# EAGLE design midi-in-out-single (EAGLE 7.7.0)
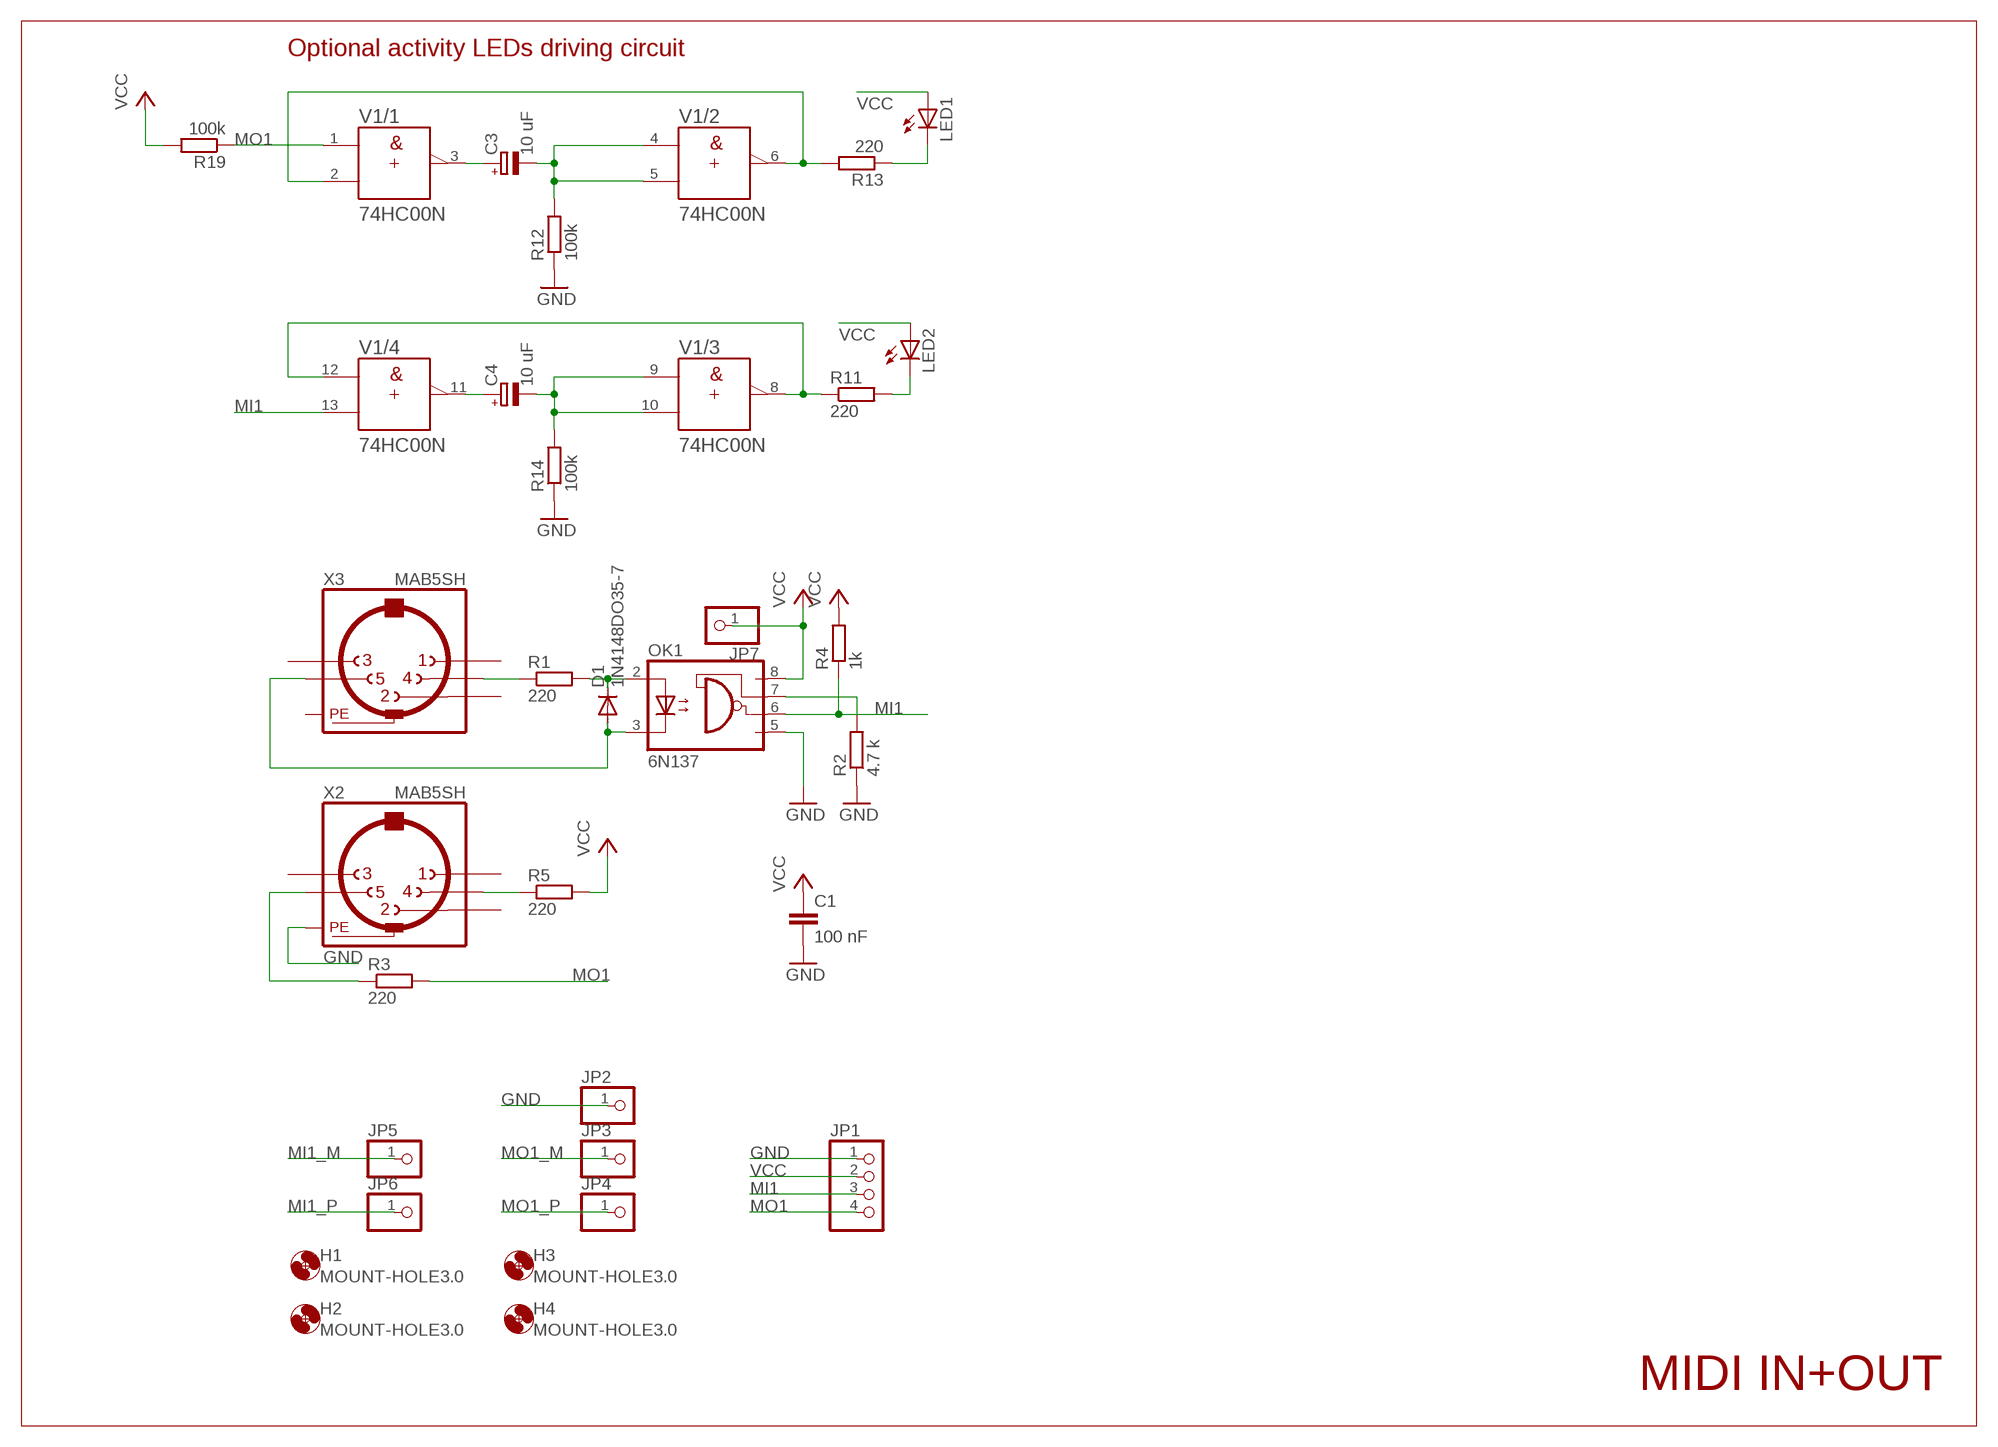
[diagram p0: schematic, sheet 1]

## Parts
C1  100 nF  C-EU025-024X044  [C025-024X044]
C3  10 uF  CPOL-EUE2.5-5  [E2,5-5]
C4  10 uF  CPOL-EUE2.5-5  [E2,5-5]
D1  1N4148DO35-7  [DO35-7]
H1  MOUNT-HOLE3.0  [3,0]
H2  MOUNT-HOLE3.0  [3,0]
H3  MOUNT-HOLE3.0  [3,0]
H4  MOUNT-HOLE3.0  [3,0]
JP1  PINHD-1X4/90  [1X04/90]
JP2  PINHD-1X1  [1X01]
JP3  PINHD-1X1  [1X01]
JP4  PINHD-1X1  [1X01]
JP5  PINHD-1X1  [1X01]
JP6  PINHD-1X1  [1X01]
JP7  PINHD-1X1  [1X01]
LED1  LED3MM  [LED3MM]
LED2  LED3MM  [LED3MM]
OK1  6N137  [DIL08]
R1  220  R-EU_0204/7  [0204/7]
R2  4.7 k  R-EU_0204/7  [0204/7]
R3  220  R-EU_0204/7  [0204/7]
R4  1k  R-EU_0204/7  [0204/7]
R5  220  R-EU_0204/7  [0204/7]
R11  220  R-EU_0204/7  [0204/7]
R12  100k  R-EU_0204/7  [0204/7]
R13  220  R-EU_0204/7  [0204/7]
R14  100k  R-EU_0204/7  [0204/7]
R19  100k  R-EU_0204/7  [0204/7]
V1  74HC00N  [DIL14]
X2  MAB5SH  [MAB5SH]
X3  MAB5SH  [MAB5SH]

## Nets
GND: C1.2 JP1.1 JP2.1 OK1.5(GND) R2.1 R12.1 R14.1 X2.PE X2.PE@(PE)
MI1: JP1.3 OK1.6(VO) R4.1 V1.13(/4:B)
MI1_M: D1.A JP5.1 OK1.3(C) X3.5
MI1_P: JP6.1 R1.1 X3.4
MO1: JP1.4 R3.2 R19.1 V1.1(/1:A)
MO1_M: JP3.1 R3.1 X2.5
MO1_P: JP4.1 R5.1 X2.4
N$1: D1.C OK1.2(A) R1.2
N$3: OK1.7(VE) R2.2
N$8: LED2.K(C) R11.2
N$10: LED1.K(C) R13.1
N$15: C4.+ V1.11(/4:Y)
N$16: C3.- R12.2 V1.4(/2:A) V1.5(/2:B)
N$17: C3.+ V1.3(/1:Y)
N$18: R13.2 V1.2(/1:B) V1.6(/2:Y)
N$19: C4.- R14.2 V1.9(/3:A) V1.10(/3:B)
N$20: R11.1 V1.8(/3:Y) V1.12(/4:A)
VCC: C1.1 JP1.2 JP7.1 LED1.A LED2.A OK1.8(VCC) R4.2 R5.2 R19.2
Unconnected: X2.1 X2.2 X2.3 X3.1 X3.2 X3.3

## Notes on the sheet
- Optional activity LEDs driving circuit
- MIDI IN+OUT

## Power pins joined to a net without a drawn wire
GND: V1.7(/-UB:-UB)
PE: X3.PE X3.PE@(PE)
VCC: V1.14(/+UB:+UB)

## Library data of the parts
C1 = rcl:C-EU: CAPACITOR, European symbol
C3 C4 = rcl:CPOL-EU: POLARIZED CAPACITOR, European symbol
D1 = diode:1N4148: DIODE high speed (Philips)
H1-H4 = holes:MOUNT-HOLE: MOUNTING HOLE with drill center marker
JP1 = pinhead:PINHD-1X4: PIN HEADER
JP2-JP7 = pinhead:PINHD-1X1: PIN HEADER
LED1 LED2 = led:LED: LED OSRAM: - CHIPLED LG R971, LG N971, LY N971, LG Q971, LY Q971, LO R971, LY R971 LH N974, LH R974 LS Q976, LO Q976, LY Q976 LO Q996 - Hyper CHIPLED LW Q18S LB Q993, LB Q99A, LB R99A - SideLED LS A670, LO A670, LY A670, LG A670, LP A670 LB A673, LV A673, LT A673, LW A673 LH A674 LY A675 LS A676, LA A676, LO A676, LY A676, LW A676 LS A679, LY A679, LG A679 - Hyper Micro SIDELED® LS Y876, LA Y876, LO Y876, LY Y876 LT Y87S - SmartLED LW L88C, LW L88S LB L89C, LB L89S, LG L890 LS L89K, LO L89K, LY L89K LS L896, LA L896, LO L896, LY L896 - TOPLED LS T670, LO T670, LY T670, LG T670, LP T670 LSG T670, LSP T670, LSY T670, LOP T670, LYG T670 LG T671, LOG T671, LSG T671 LB T673, LV T673, LT T673, LW T673 LH T674 LS T676, LA T676, LO T676, LY T676, LB T676, LH T676, LSB T676, LW T676 LB T67C, LV T67C, LT T67C, LS T67K, LO T67K, LY T67K, LW E67C LS E67B, LA E67B, LO E67B, LY E67B, LB E67C, LV E67C, LT E67C LW T67C LS T679, LY T679, LG T679 LS T770, LO T770, LY T770, LG T770, LP T770 LB T773, LV T773, LT T773, LW T773 LH T774 LS E675, LA E675, LY E675, LS T675 LS T776, LA T776, LO T776, LY T776, LB T776 LHGB T686 LT T68C, LB T68C - Hyper Mini TOPLED® LB M676 - Mini TOPLED Santana® LG M470 LS M47K, LO M47K, LY M47K Source: http://www.osram.convergy.de LUXEON: - LUMILED® LXK2-PW12-R00, LXK2-PW12-S00, LXK2-PW14-U00, LXK2-PW14-V00 LXK2-PM12-R00, LXK2-PM12-S00, LXK2-PM14-U00 LXK2-PE12-Q00, LXK2-PE12-R00, LXK2-PE12-S00, LXK2-PE14-T00, LXK2-PE14-U00 LXK2-PB12-K00, LXK2-PB12-L00, LXK2-PB12-M00, LXK2-PB14-N00, LXK2-PB14-P00, LXK2-PB14-Q00 LXK2-PR12-L00, LXK2-PR12-M00, LXK2-PR14-Q00, LXK2-PR14-R00 LXK2-PD12-Q00, LXK2-PD12-R00, LXK2-PD12-S00 LXK2-PH12-R00, LXK2-PH12-S00 LXK2-PL12-P00, LXK2-PL12-Q00, LXK2-PL12-R00 Source: www.luxeon.com KINGBRIGHT: KA-3528ASYC Source: www.kingbright.com
OK1 = optocoupler:6N137: MOTOROLA OPTO COUPLER; MPN: 6N137; OC_FARNELL: 1328376; OC_NEWARK: 52M1895
R1-R5 R11-R14 R19 = rcl:R-EU_: RESISTOR, European symbol
V1 = 74ttl-din:74*00: Quad 2-input NAND gate
X2 X3 = con-hirschmann:MAB5SH: Female CONNECTOR 5 pins 90 deg. with shield, horizontal (DIN 41524); OC_FARNELL: 809883; OC_NEWARK: unknown

## Board
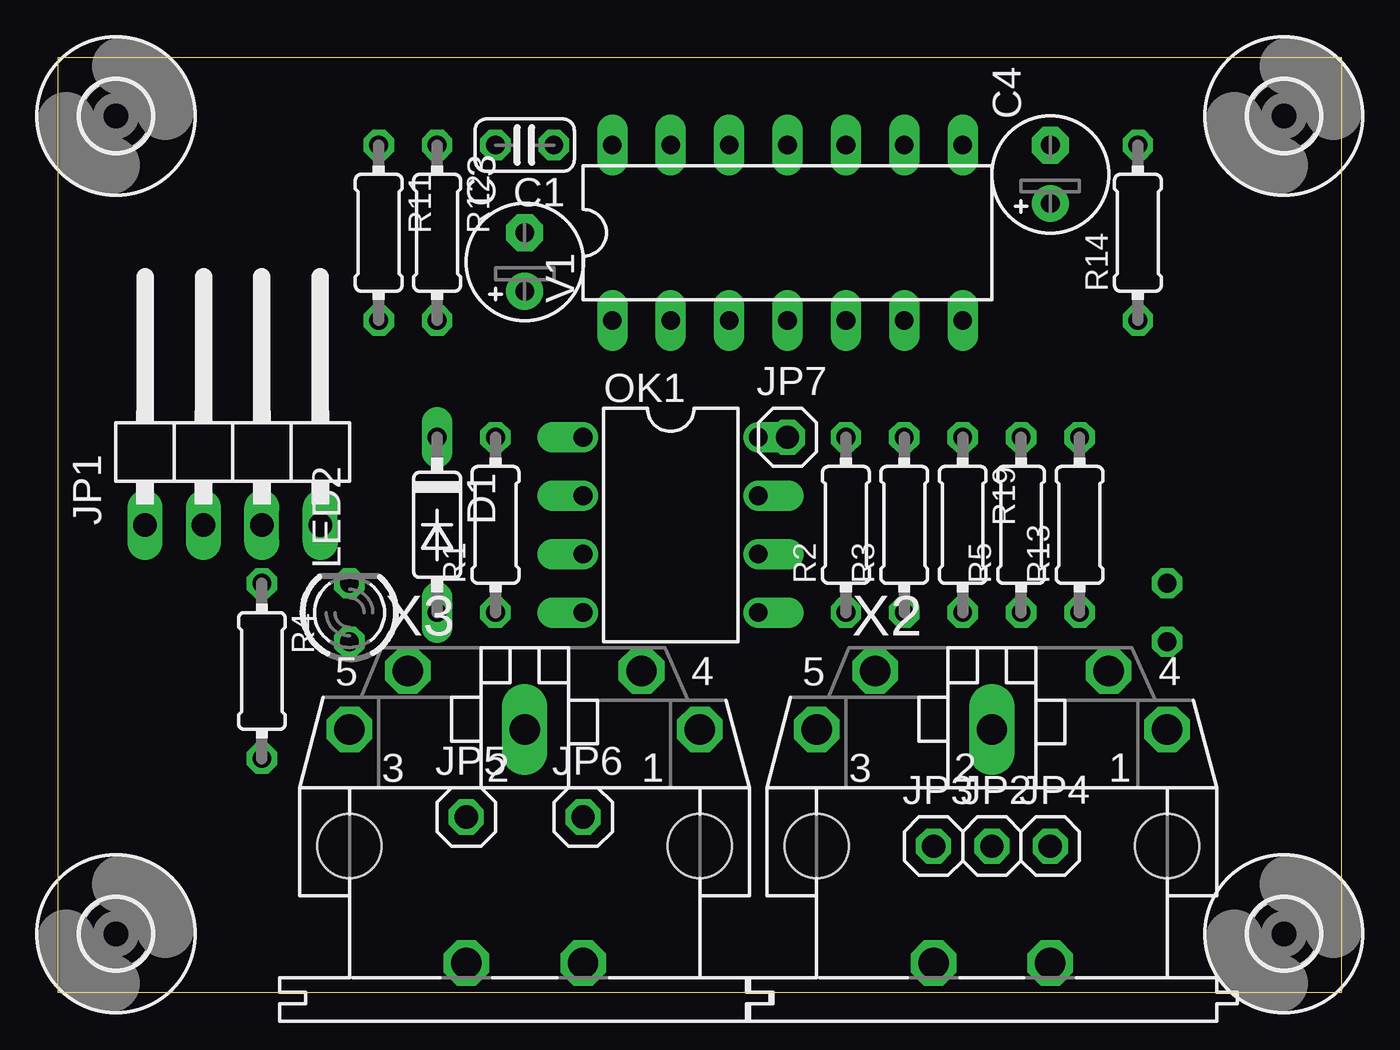
[diagram p1: board, top side]
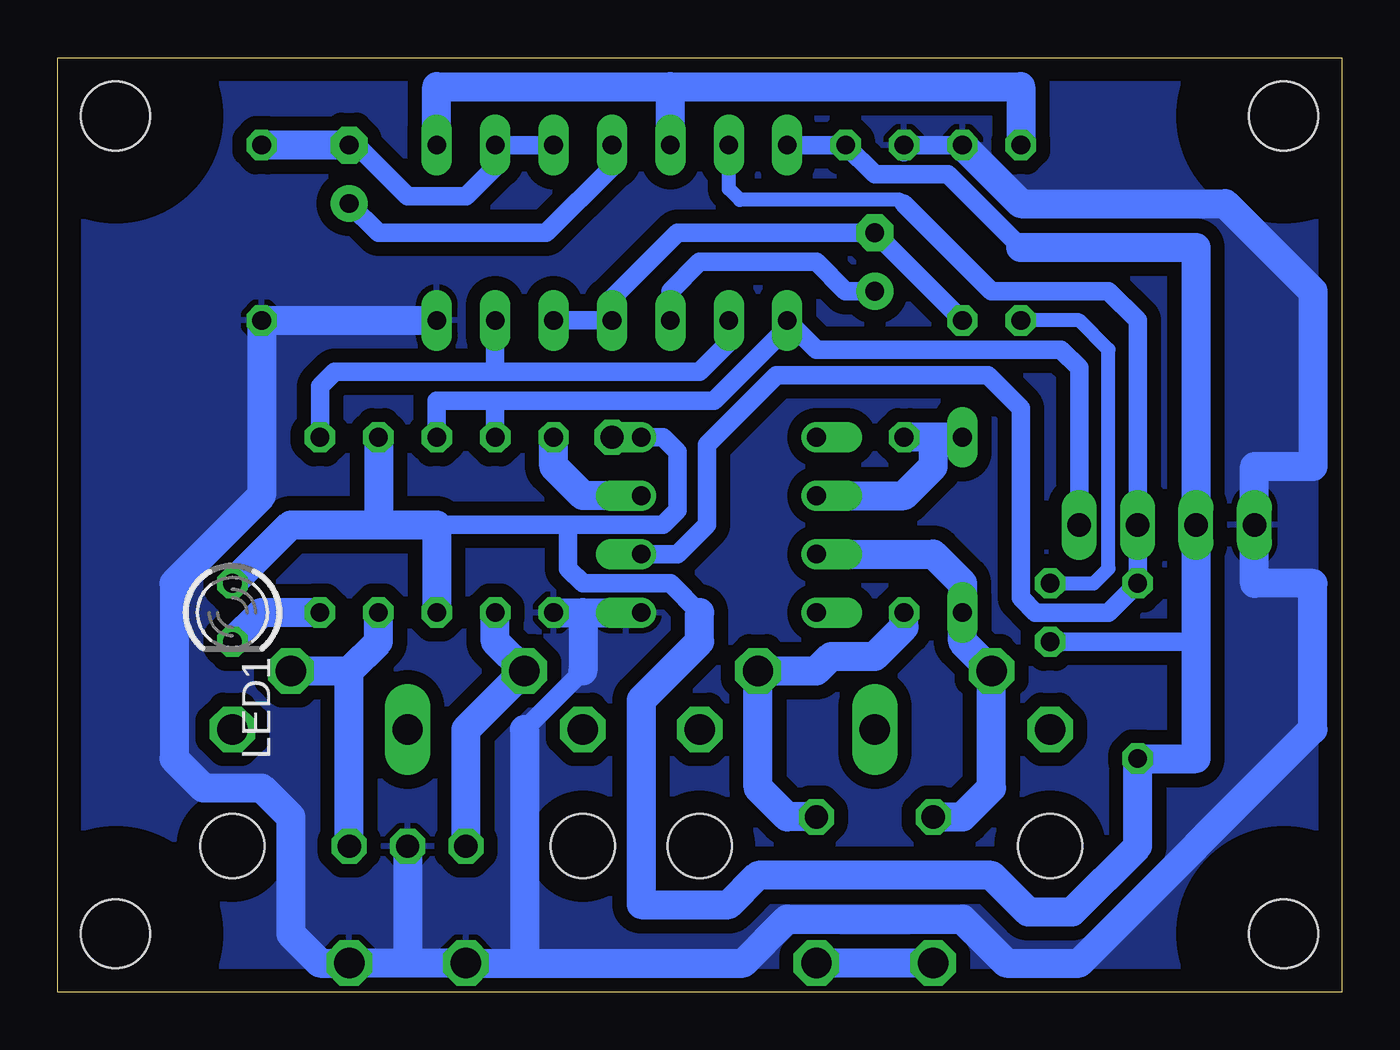
[diagram p2: board, bottom side, seen from below]

Size 55.87 x 40.63 mm. Coordinates in mm from the lower left corner, seen from the top.
Outline: 0,0 55.87,0 55.87,40.63 0,40.63 0,0
Copper layers (1*16): Top 0.035mm / dielectric 1.5mm / Bottom 0.035mm
Design rules "default": minimum track width 10mil, minimum drill 24mil, track to track 8mil, track to pad 8mil, pad to pad 8mil, via to via 8mil, smd to smd 8mil, copper to edge 40mil, drill to drill 8mil, minimum pad ring 10mil, minimum via ring 8mil, stop-mask expansion 4mil, vias tented up to drill 0mil, thermal gap 10mil

### Footprints (pad centres in the part's own frame; a part is rotated, then mirrored left to right if it is on the bottom)
C025-024X044 = drill 0.813 octagon: 1 -1.27,0; 2 1.27,0
E2,5-5 = drill 0.813 pad 1.6: + -1.27,0 | drill 0.813 pad 1.6 octagon: - 1.27,0
DO35-7 = drill 0.813 long: A 3.81,0; C -3.81,0
3,0 = hole 3: 0,0
1X04/90 = drill 1.016 long: 1 -3.81,-3.81; 2 -1.27,-3.81; 3 1.27,-3.81; 4 3.81,-3.81
1X01 = drill 1.016 octagon: 1 0,0
LED3MM = drill 0.813 octagon: A -1.27,0; K 1.27,0
DIL08 = drill 0.813 offset: 1 -3.81,-3.81; 2 -1.27,-3.81; 3 1.27,-3.81; 4 3.81,-3.81; 5 3.81,3.81; 6 1.27,3.81; 7 -1.27,3.81; 8 -3.81,3.81
0204/7 = drill 0.813 octagon: 1 -3.81,0; 2 3.81,0
DIL14 = drill 0.813 long: 1 -7.62,-3.81; 2 -5.08,-3.81; 3 -2.54,-3.81; 4 0,-3.81; 5 2.54,-3.81; 6 5.08,-3.81; 7 7.62,-3.81; 8 7.62,3.81; 9 5.08,3.81; 10 2.54,3.81; 11 0,3.81; 12 -2.54,3.81; 13 -5.08,3.81; 14 -7.62,3.81
MAB5SH = drill 1.321 octagon: 1 7.62,5.08; 3 -7.62,5.08; 4 5.08,7.62; 5 -5.08,7.62; PE -2.54,-5.08; PE@ 2.54,-5.08 | drill 1.321 long: 2 0,5.08 | hole 2.794: 7.62,0; -7.62,0

### Placement (x,y rotation side)
C1  20.32,36.83 180 top
C3  20.32,31.75 90 top
C4  43.18,35.56 90 top
D1  16.51,20.32 270 top
H1  2.54,2.54 0 top
H2  53.34,2.54 0 top
H3  53.34,38.1 0 top
H4  2.54,38.1 0 top
JP1  7.62,24.13 0 top
JP2  40.64,6.35 0 top
JP3  38.1,6.35 0 top
JP4  43.18,6.35 0 top
JP5  17.78,7.62 0 top
JP6  22.86,7.62 0 top
JP7  31.75,24.13 0 top
LED1  48.26,16.51 270 bottom
LED2  12.7,16.51 90 top
OK1  26.67,20.32 270 top
R1  19.05,20.32 90 top
R2  34.29,20.32 90 top
R3  36.83,20.32 90 top
R4  8.89,13.97 270 top
R5  41.91,20.32 90 top
R11  13.97,33.02 270 top
R12  16.51,33.02 270 top
R13  44.45,20.32 90 top
R14  46.99,33.02 90 top
R19  39.37,20.32 270 top
V1  31.75,33.02 0 top
X2  40.64,6.35 0 top
X3  20.32,6.35 0 top

### Tracks (layer width: path | path; a pad name or v marks a point on that pad's centre or on a via)
GND
  Bottom 0.8: 33.02,13.97 35.56,11.43
  Bottom 0.813: R12.1 C1.2 19.05,36.51
  Bottom 1.27: 33.02,16.51 OK1.5 | V1.7 R14.1 46.99,21.59 50.8,17.78 50.8,10.16 49.53,8.89 46.99,8.89 45.72,7.62 45.72,2.54 44.45,1.27 X2.PE@ 40.64,1.27 | R12.1 13.97,34.29 5.08,34.29 1.27,30.48 1.27,22.86 3.81,22.86 JP1.1 3.81,17.78 1.27,17.78 1.27,11.43 11.43,1.27 14.61,1.27 16.51,3.17 24.13,3.17 26.04,1.27 35.56,1.27 | 35.56,1.27 X2.PE 40.64,1.27 | JP2.1 40.64,1.27 | R2.1 33.02,16.51 | 33.02,16.51 33.02,13.97 | 35.56,11.43 35.56,1.27
  pour Bottom (isolate 0.61): 0,0 55.88,0 55.88,40.64 0,40.64
MI1
  Bottom 0.61: 19.05,34.29 19.21,34.45 26.19,34.45 26.67,34.92 V1.13
  Bottom 0.8: OK1.6 28.89,19.05 27.62,20.32 27.62,23.81 24.61,26.83 15.4,26.83 13.97,25.4 13.97,17.14 13.34,16.51 10.16,16.51 R4.1 JP1.3 8.89,29.21 10.16,30.48 15.24,30.48 19.05,34.29
MI1_M
  Bottom 1.27: OK1.3 17.78,19.05 16.51,17.78 D1.A 16.51,15.24 X3.5 15.24,8.89 16.51,7.62 JP5.1
MI1_P
  Bottom 1.27: R1.1 19.05,15.88 20.32,14.61 22.23,14.61 22.86,13.97 X3.4 25.4,8.89 24.13,7.62 JP6.1
MO1
  Bottom 0.61: 24.13,28.89 V1.1
  Bottom 0.8: R19.1 39.37,25.72 36.83,25.72 | 36.83,25.72 27.3,25.72 24.13,28.89 | R3.2 36.83,25.72 | JP1.4 11.43,27.15 12.22,27.94 22.86,27.94 V1.1
MO1_M
  Bottom 1.27: R3.1 36.83,15.24 X2.5 38.1,11.43 JP3.1
MO1_P
  Bottom 1.27: JP4.1 43.18,13.97 | 43.18,13.97 41.91,15.24 R5.1 | X2.4 43.18,13.97
N$1
  Bottom 1.27: D1.C 17.78,24.13 | 17.78,24.13 R1.2 | OK1.2 19.05,21.59 17.78,22.86 17.78,24.13
N$3
  Bottom 1.27: OK1.7 33.02,21.59 34.29,22.86 R2.2
N$8
  Bottom 0.61: LED2.K 10.79,17.78 10.16,18.41 10.16,27.94 11.43,29.21 R11.2
N$10
  Bottom 1.27: R13.1 46.99,16.51 LED1.K
N$15
  Bottom 0.813: V1.11 31.75,35.88 34.61,33.02 41.91,33.02 C4.+
N$16
  Bottom 0.813: V1.5 V1.4 31.75,30.16 28.89,33.02 C3.- R12.2
N$17
  Bottom 0.813: C3.+ 21.59,30.48 22.86,31.75 27.94,31.75 29.21,30.48 V1.3
N$18
  Bottom 0.8: R13.2 44.45,26.35 43.81,26.99
  Bottom 0.813: 43.81,26.99 36.83,26.99 | 36.83,26.99 27.94,26.99 26.67,28.26 V1.2 | V1.6 36.83,26.99
N$19
  Bottom 0.8: V1.10 V1.9 | 36.83,35.88 38.1,34.61
  Bottom 0.813: V1.9 36.83,35.88 | 38.1,34.61 40.64,34.61 42.86,36.83 C4.-
  Bottom 1.27: C4.- R14.2
N$20
  Bottom 1.27: V1.12 29.21,39.37 | 29.21,39.37 13.97,39.37 R11.1 | V1.8 39.37,39.37 29.21,39.37
PE
  Bottom 1.27: X3.PE X3.PE@
VCC
  Bottom 0.8: OK1.8 29.53,24.13 28.89,23.5 28.89,20.95 29.53,20.32 33.66,20.32 | 33.66,20.32 39.37,20.32 | 13.97,32.38 17.14,35.56 20.32,35.56 C1.1 V1.14 | LED2.A 6.35,15.24 | 27.94,16.51 29.21,17.78 33.02,17.78 33.66,18.41 33.66,20.32
  Bottom 1.27: R19.2 39.37,20.32 41.91,20.32 | 41.91,20.32 45.72,20.32 LED1.A | 13.97,32.38 6.35,32.38 JP1.2 6.35,15.24 6.35,10.16 R4.2 8.89,6.35 11.75,3.49 13.65,3.49 15.24,5.08 25.4,5.08 26.67,3.81 30.48,3.81 30.48,12.7 27.94,15.24 27.94,16.51 | JP7.1 OK1.8 | R5.2 41.91,20.32